# EAGLE board v1-1-0b (EAGLE 9.6.2), part 1 of 3
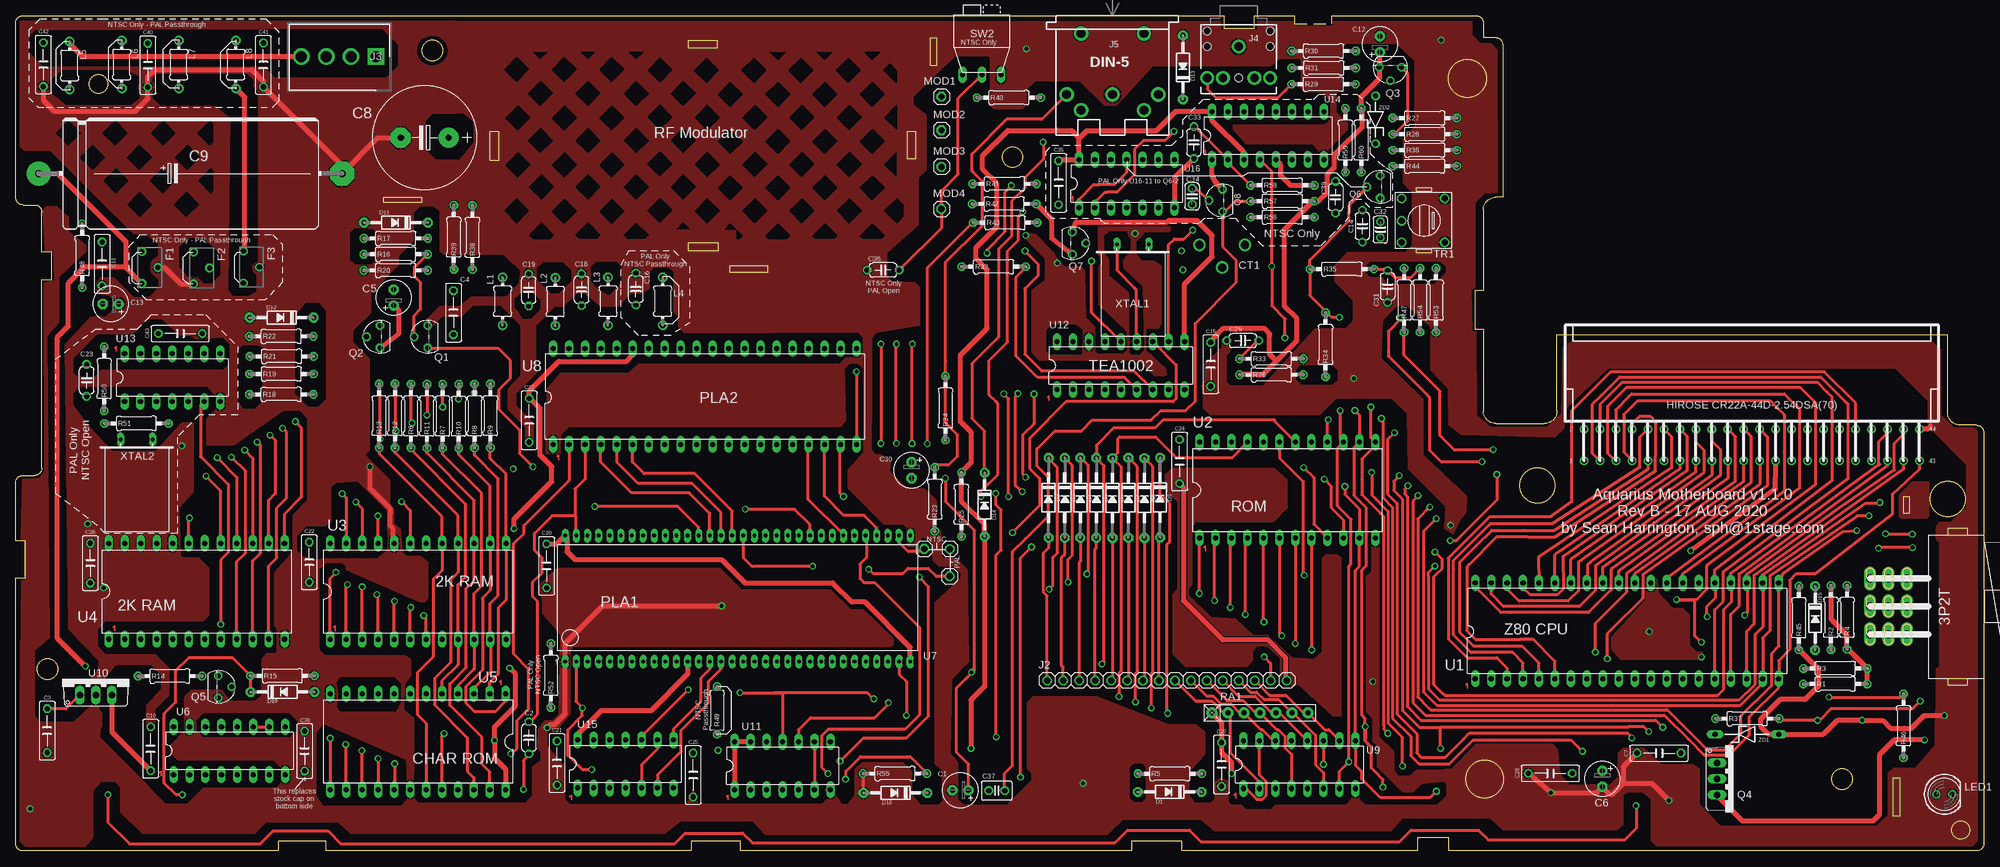
[diagram p2: board, top side]
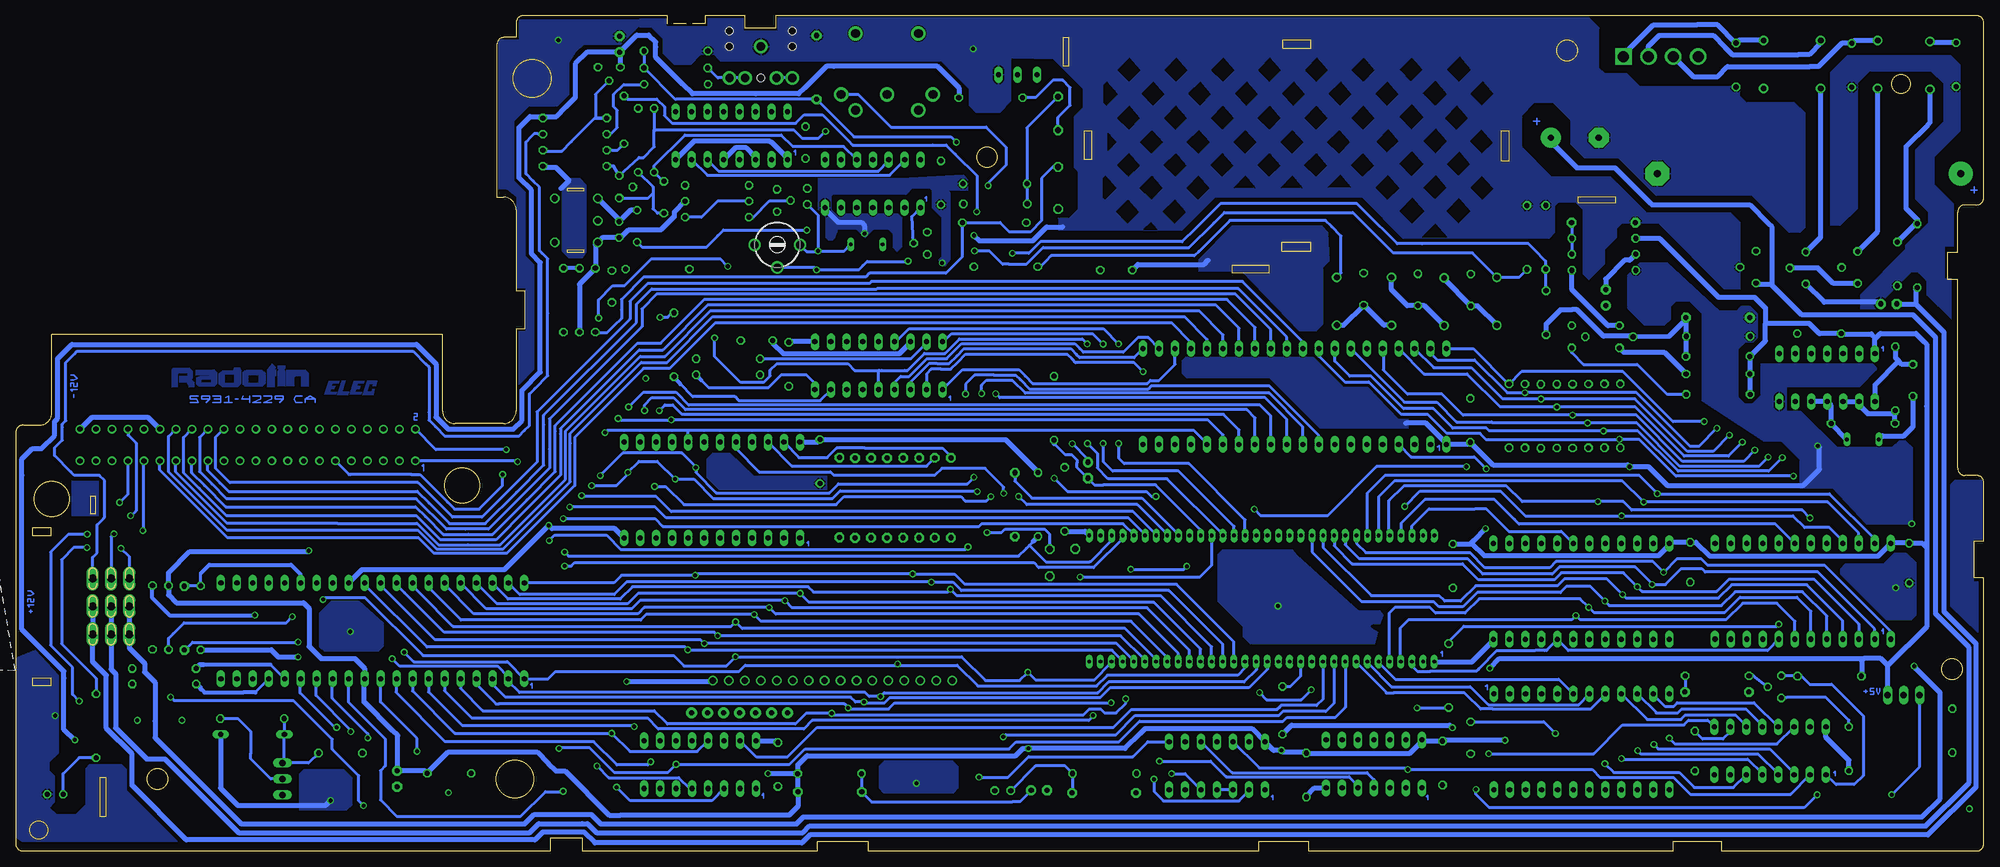
[diagram p3: board, bottom side, seen from below]

Size 313.03 x 132.89 mm. Coordinates in mm from the lower left corner, seen from the top.
Outline: 69 segments
Outline: circle at 5.03,28.96 radius 1.63
Outline: circle at 158.55,110.39 radius 1.63
Outline: circle at 290.47,11.46 radius 1.63
Outline: circle at 242.01,58.14 radius 2.79
Outline: circle at 307.31,56.03 radius 2.79
Outline: circle at 66.27,127.36 radius 1.63
Outline: circle at 13.13,122.02 radius 1.47
Copper layers (1*16): Top 0.035mm / dielectric 1.5mm / Bottom 0.035mm
Design rules "default *": minimum track width 6mil, minimum drill 0.35mm, track to track 6mil, track to pad 6mil, pad to pad 6mil, via to via 6mil, smd to smd 6mil, copper to edge 0mil, drill to drill 6mil, minimum pad ring 10mil, minimum via ring 8mil, stop-mask expansion 4mil, vias tented up to drill 0mil, thermal gap 10mil
Milling: area 230.6,8.4 to 236.6,14.4; area 227.9,119.9 to 233.9,125.9; area 307.9,1.9 to 310.8,4.7; 36 lines

## Footprints (pad centres in the part's own frame; a part is rotated, then mirrored left to right if it is on the bottom)
E2,5-6 = drill 0.813 pad 1.6: + -1.27,0 | drill 0.813 pad 1.6 octagon: - 1.27,0
C050-024X044 = drill 0.813 octagon: 1 -2.54,0; 2 2.54,0
C050-025X090 = drill 0.813 octagon: 1 -3.556,0; 2 3.429,0
E7,5-16 = drill 1.016 pad 3.15: + -3.81,0 | drill 1.016 pad 3.15 octagon: - 3.81,0
E45-18 = drill 1.118 pad 3.81: + -24.13,0 | drill 1.118 pad 3.81 octagon: - 24.13,0
C050-025X085 = drill 0.813 octagon: 1 -3.175,0; 2 3.175,0
C025-024X044 = drill 0.813 octagon: 1 -1.27,0; 2 1.27,0
C025-030X050 = drill 0.813 octagon: 1 -1.27,0; 2 1.27,0
CTRIM808-BC = drill 1.3: 1 -3.607,0; 2 0,3.607; 3 3.607,0
DO35-10 = drill 0.813 pad 1.524 octagon: A 5.08,0; C -5.08,0
DO35-12 = drill 0.813 pad 1.524 octagon: A 7.62,0; C -5.08,0
LCL = drill 0.813 octagon: 0 0,1.27; 1 -2.54,-1.27; 2 2.54,-1.27
CR22A-44D-2.54DSA(70) = drill 0.85: P$1 -25.4,-11.43; P$2 -25.4,-6.35; P$3 -22.86,-11.43; P$4 -22.86,-6.35; P$5 -20.32,-11.43; P$6 -20.32,-6.35; P$7 -17.78,-11.43; P$8 -17.78,-6.35; P$9 -15.24,-11.43; P$10 -15.24,-6.35; P$11 -12.7,-11.43; P$12 -12.7,-6.35; P$13 -10.16,-11.43; P$14 -10.16,-6.35; P$15 -7.62,-11.43; P$16 -7.62,-6.35; P$17 -5.08,-11.43; P$18 -5.08,-6.35; P$19 -2.54,-11.43; P$20 -2.54,-6.35; P$21 0,-11.43; P$22 0,-6.35; P$23 2.54,-11.43; P$24 2.54,-6.35; P$25 5.08,-11.43; P$26 5.08,-6.35; P$27 7.62,-11.43; P$28 7.62,-6.35; P$29 10.16,-11.43; P$30 10.16,-6.35; P$31 12.7,-11.43; P$32 12.7,-6.35; P$33 15.24,-11.43; P$34 15.24,-6.35; P$35 17.78,-11.43; P$36 17.78,-6.35; P$37 20.32,-11.43; P$38 20.32,-6.35; P$39 22.86,-11.43; P$40 22.86,-6.35; P$41 25.4,-11.43; P$42 25.4,-6.35; P$43 27.94,-11.43; P$44 27.94,-6.35
1X16 = drill 1.016: 1 -19.05,0; 2 -16.51,0; 3 -13.97,0; 4 -11.43,0; 5 -8.89,0; 6 -6.35,0; 7 -3.81,0; 8 -1.27,0; 9 1.27,0; 10 3.81,0; 11 6.35,0; 12 8.89,0; 13 11.43,0; 14 13.97,0; 15 16.51,0; 16 19.05,0
SHDR4W155P0X396_1X4_1570X1001X = drill 1.75 pad 2.625 square: 1 0,0 | drill 1.75 pad 2.625: 2 -3.96,0; 3 -7.92,0; 4 -11.88,0
AUDIO-JACK = drill 1.3 pad 2.184: RING 5,5; RSH 5,2.5; SLEEVE 0,0; TIP 5,-5; TSH 5,-2.5 | hole 1.2: 0,5; -2.5,5; -2.5,-5; 0,-5; 5,0
DIN5-RA-PTH = drill 1.4 pad 2.286: 1 7.3,12.5; 2 0,12.5; 3 -7.3,12.5; 4 5,15; 5 -5,15; 6 -5,2.8; 7 5,2.8
1X01 = drill 1.016 octagon: 1 0,0
TFI0305 = drill 0.9 pad 1.5: 1 -3.81,0; 2 3.81,0
LED5MM = drill 0.813 octagon: A -1.27,0; K 1.27,0
TO92-E1 = drill 0.813 octagon: 1 -1.778,0; 2 0,2.159; 3 1.778,0
TO220V = drill 1.016 long: 1 -2.54,-2.54; 2 0,-2.54; 3 2.54,-2.54
0207/10 = drill 0.813 octagon: 1 -5.08,0; 2 5.08,0
0207/7 = drill 0.813 octagon: 1 -3.81,0; 2 3.81,0
RN-7 = drill 0.813 pad 1.778: 1 -7.62,0; 2 -5.08,0; 3 -2.54,0; 4 0,0; 5 2.54,0; 6 5.08,0; 7 7.62,0
3PDT-AQ-SWITCH = drill 1.27 long: P$1A -2.921,0; P$1B -2.921,-4.445; P$1C -2.921,4.445; P$2A 0,0; P$2B 0,-4.445; P$2C 0,4.445; P$3A 2.921,0; P$3B 2.921,-4.445; P$3C 2.921,4.445
9077-1 = drill 0.813 long: 1 -3.048,-1.016; 2 0,-1.016; 3 3.048,-1.016
10MM-DUAL = drill 1: P$1 -3.556,-3.429; P$2 -3.556,3.556; P$3 3.302,-3.429; P$4 3.302,3.556
DIL40 = drill 0.813 long: 1 -24.13,-7.62; 2 -21.59,-7.62; 3 -19.05,-7.62; 4 -16.51,-7.62; 5 -13.97,-7.62; 6 -11.43,-7.62; 7 -8.89,-7.62; 8 -6.35,-7.62; 9 -3.81,-7.62; 10 -1.27,-7.62; 11 1.27,-7.62; 12 3.81,-7.62; 13 6.35,-7.62; 14 8.89,-7.62; 15 11.43,-7.62; 16 13.97,-7.62; 17 16.51,-7.62; 18 19.05,-7.62; 19 21.59,-7.62; 20 24.13,-7.62; 21 24.13,7.62; 22 21.59,7.62; 23 19.05,7.62; 24 16.51,7.62; 25 13.97,7.62; 26 11.43,7.62; 27 8.89,7.62; 28 6.35,7.62; 29 3.81,7.62; 30 1.27,7.62; 31 -1.27,7.62; 32 -3.81,7.62; 33 -6.35,7.62; 34 -8.89,7.62; 35 -11.43,7.62; 36 -13.97,7.62; 37 -16.51,7.62; 38 -19.05,7.62; 39 -21.59,7.62; 40 -24.13,7.62
DIL24-6 = drill 0.813 long: 1 -13.97,-7.62; 2 -11.43,-7.62; 3 -8.89,-7.62; 4 -6.35,-7.62; 5 -3.81,-7.62; 6 -1.27,-7.62; 7 1.27,-7.62; 8 3.81,-7.62; 9 6.35,-7.62; 10 8.89,-7.62; 11 11.43,-7.62; 12 13.97,-7.62; 13 13.97,7.62; 14 11.43,7.62; 15 8.89,7.62; 16 6.35,7.62; 17 3.81,7.62; 18 1.27,7.62; 19 -1.27,7.62; 20 -3.81,7.62; 21 -6.35,7.62; 22 -8.89,7.62; 23 -11.43,7.62; 24 -13.97,7.62
DIL16 = drill 0.813 long: 1 -8.89,-3.81; 2 -6.35,-3.81; 3 -3.81,-3.81; 4 -1.27,-3.81; 5 1.27,-3.81; 6 3.81,-3.81; 7 6.35,-3.81; 8 8.89,-3.81; 9 8.89,3.81; 10 6.35,3.81; 11 3.81,3.81; 12 1.27,3.81; 13 -1.27,3.81; 14 -3.81,3.81; 15 -6.35,3.81; 16 -8.89,3.81
HD61K202P-PLA1 = drill 0.6 long: 1 1.27,-1.778; 2 3.048,-1.778; 3 4.818,-1.778; 4 6.588,-1.778; 5 8.358,-1.778; 6 10.127,-1.778; 7 11.897,-1.778; 8 13.667,-1.778; 9 15.437,-1.778; 10 17.207,-1.778; 11 18.977,-1.778; 12 20.747,-1.778; 13 22.517,-1.778; 14 24.286,-1.778; 15 26.056,-1.778; 16 27.826,-1.778; 17 29.596,-1.778; 18 31.366,-1.778; 19 33.136,-1.778; 20 34.906,-1.778; 21 36.676,-1.778; 22 38.445,-1.778; 23 40.215,-1.778; 24 41.985,-1.778; 25 43.755,-1.778; 26 45.525,-1.778; 27 47.295,-1.778; 28 49.065,-1.778; 29 50.835,-1.778; 30 52.604,-1.778; 31 54.374,-1.778; 32 56.144,-1.778; 33 56.134,18.288; 34 54.356,18.288; 35 52.586,18.288; 36 50.816,18.288; 37 49.046,18.288; 38 47.277,18.288; 39 45.507,18.288; 40 43.737,18.288; 41 41.967,18.288; 42 40.197,18.288; 43 38.427,18.288; 44 36.657,18.288; 45 34.887,18.288; 46 33.118,18.288; 47 31.348,18.288; 48 29.578,18.288; 49 27.808,18.288; 50 26.038,18.288; 51 24.268,18.288; 52 22.498,18.288; 53 20.728,18.288; 54 18.959,18.288; 55 17.189,18.288; 56 15.419,18.288; 57 13.649,18.288; 58 11.879,18.288; 59 10.109,18.288; 60 8.339,18.288; 61 6.569,18.288; 62 4.8,18.288; 63 3.03,18.288; 64 1.26,18.288
DIL14 = drill 0.813 long: 1 -7.62,-3.81; 2 -5.08,-3.81; 3 -2.54,-3.81; 4 0,-3.81; 5 2.54,-3.81; 6 5.08,-3.81; 7 7.62,-3.81; 8 7.62,3.81; 9 5.08,3.81; 10 2.54,3.81; 11 0,3.81; 12 -2.54,3.81; 13 -5.08,3.81; 14 -7.62,3.81
DIL18 = drill 0.813 long: 1 -10.16,-3.81; 2 -7.62,-3.81; 3 -5.08,-3.81; 4 -2.54,-3.81; 5 0,-3.81; 6 2.54,-3.81; 7 5.08,-3.81; 8 7.62,-3.81; 9 10.16,-3.81; 10 10.16,3.81; 11 7.62,3.81; 12 5.08,3.81; 13 2.54,3.81; 14 0,3.81; 15 -2.54,3.81; 16 -5.08,3.81; 17 -7.62,3.81; 18 -10.16,3.81
Q = drill 0.61 long: 1 -2.54,-7.62; 2 2.54,-7.62
ZDIO-10 = drill 0.813 long: A 5.08,0; C -5.08,0
ZDIO-7.5 = drill 0.813 octagon: A 3.81,0; C -3.81,0

## Placement (x,y rotation side)
C1  1uF @ 50v  [E2,5-6]  150.24,9.63 180 top
C2  10pF  [C050-024X044]  81.61,18.01 270 top
C3  .22uF  [C050-025X090]  5,19.08 270 top
C4  .1uF  [C050-025X090]  69.62,85.57 270 top
C5  2.2uF @ 50v  [E2,5-6]  60.12,88.06 90 top
C6  47uF @ 10v  [E2,5-6]  252.37,11.51 270 top
C7  .1uF @ 25v  [C050-025X090]  261.44,15.57 0 top
C8  1000uF @ 25v  [E7,5-16]  65.05,113.49 180 top
C9  10000uF @ 16v  [E45-18]  27.76,107.8 0 top
C10  .1uF  [C050-025X090]  21.46,16.21 270 top
C11  .1uF  [C050-025X090]  13.74,93.34 270 top
C12  10uF @ 16v  [E2,5-6]  216.99,128.35 90 top
C13  10uF @ 25v  [E2,5-6]  15.14,87.05 180 top
C14  .022uF  [C050-024X044]  214.2,99.42 90 top
C15  .1uF  [C050-025X090]  190.07,77.37 270 top
C16  82pF  [C050-024X044]  98.63,89.41 270 top
C17  .1uF  [C050-025X090]  81.66,68.45 270 top
C18  82pF  [C050-024X044]  89.99,89.31 270 top
C19  82pF  [C050-024X044]  81.58,89.26 270 top
C20  .1uF  [C050-025X090]  84.43,45.29 270 top
C21  .1uF  [C050-025X090]  86.08,13.92 270 top
C22  .1uF  [C050-025X085]  46.69,45.95 270 top
C23  10pF  [C050-024X044]  11.28,74.88 270 top
C24  .1uF  [C050-025X090]  185.12,61.9 270 top
C25  .1uF  [C050-025X090]  107.75,12.01 270 top
C26  .1uF  [C050-025X085]  11.86,45.8 270 top
C27  .1uF  [C050-025X090]  191.8,13.69 270 top
C28  .1uF  [C050-025X090]  244.14,12.34 0 top
C29  150pF  [C050-024X044]  195.17,81.2 0 top
C30  10uF @ 16v  [E2,5-6]  142.47,60.58 270 top
C31  .1uF  [C050-024X044]  218.21,89.81 90 top
C32  100pF  [C025-024X044]  217.07,98.86 90 top
C33  680pF  [C050-024X044]  187.4,112.73 90 top
C34  2pF  [C025-024X044]  187.12,104.14 90 top
C35  .1uF  [C050-025X090]  165.86,106.25 270 top
C36  .01uF  [C050-024X044]  137.97,92.43 0 top
C37  .001uF  [C025-030X050]  156.03,9.6 0 top
C38  .1uF  [C050-025X085]  45.95,15.9 90 top
C39  56pF  [C050-024X044]  209.93,104.01 90 top
C40  .02uF  [C050-025X090]  21.01,124.94 270 top
C41  .02uF  [C050-025X090]  39.4,124.99 270 top
C42  .02uF  [C050-025X090]  4.39,125.04 270 top
C43  .1uF  [C050-025X090]  26.24,82.32 0 top
CT1  [CTRIM808-BC]  191.9,96.44 180 bottom
D1  1N4148  [DO35-10]  183.54,9.4 180 top
D2  1N4148H  [DO35-12]  164.29,57.45 270 top
D3  1N4148H  [DO35-12]  166.85,57.45 270 top
D4  1N4148H  [DO35-12]  169.34,57.45 270 top
D5  1N4148H  [DO35-12]  171.88,57.45 270 top
D6  1N4148H  [DO35-12]  174.45,57.43 270 top
D7  1N4148H  [DO35-12]  176.99,57.45 270 top
D8  1N4148H  [DO35-12]  179.53,57.43 270 top
D9  1N4148H  [DO35-12]  182.02,57.51 270 top
D10  1N4148  [DO35-10]  42.44,25.3 0 top
D11  1N4148  [DO35-10]  60.48,99.97 180 top
D12  1N4148  [DO35-10]  42.29,84.86 180 top
D13  1N4148  [DO35-10]  185.65,124.66 90 top
D14  1N4148  [DO35-10]  154.1,55.09 270 top
D15  1N4148  [DO35-10]  286.21,37.06 270 top
D16  1N4148  [DO35-10]  139.93,9.25 180 top
F1  [LCL]  21.34,92.84 270 top
F2  [LCL]  29.57,92.76 270 top
F3  [LCL]  37.49,92.89 270 top
J1  CR22A-44D-2.54DSA(70)  [CR22A-44D-2.54DSA(70)]  274.85,73.48 0 top
J2  [1X16]  183.11,27.13 0 top
J3  26-60-4040  [SHDR4W155P0X396_1X4_1570X1001X]  57.3,126.39 0 top
J4  AUDIO_JACK_3.5MM_PTH  [AUDIO-JACK]  194.51,127.99 270 top
J5  DIN5  [DIN5-RA-PTH]  174.45,132.87 180 top
JP1  [1X01]  148.54,43.71 0 top
JP2  [1X01]  144.5,48.06 0 top
JP3  [1X01]  148.56,48.03 0 top
L1  [TFI0305]  77.44,87.45 90 top
L2  [TFI0305]  85.83,87.4 90 top
L3  [TFI0305]  94.21,87.45 90 top
L4  [TFI0305]  102.9,87.48 90 top
L5  [TFI0305]  8.59,124.97 270 top
L6  [TFI0305]  16.87,125.12 270 top
L7  [TFI0305]  25.93,125.12 270 top
L8  [TFI0305]  35,125.15 270 top
LED1  [LED5MM]  306.76,9.02 0 top
MOD1  [1X01]  147.24,120.02 0 top
MOD2  [1X01]  147.24,114.68 0 top
MOD3  [1X01]  147.24,108.86 0 top
MOD4  [1X01]  147.22,102.13 0 top
Q1  [TO92-E1]  65.53,81.81 90 top
Q2  [TO92-E1]  57.94,81.81 90 top
Q3  [TO92-E1]  218.64,124.71 180 top
Q4  [TO220V]  273.18,11.46 270 top
Q5  [TO92-E1]  32.21,26.11 270 top
Q6  [TO92-E1]  217.04,105.66 90 top
Q7  [TO92-E1]  168.05,96.7 270 top
Q8  [TO92-E1]  191.95,103.5 90 top
R1  1k  [0207/10]  289.41,26.57 0 top
R2  1k  [0207/10]  288.72,37.13 90 top
R3  1k  [0207/10]  289.43,29.03 0 top
R4  1k  [0207/10]  291.29,37.16 90 top
R5  10k  [0207/10]  183.57,12.29 0 top
R6  820  [0207/10]  62.87,69.22 90 top
R7  820  [0207/10]  67.89,69.19 90 top
R8  820  [0207/10]  72.97,69.22 90 top
R9  820  [0207/10]  75.49,69.24 90 top
R10  820  [0207/10]  70.46,69.16 90 top
R11  820  [0207/10]  65.41,69.19 90 top
R12  820  [0207/10]  60.33,69.24 90 top
R13  820  [0207/10]  57.81,69.24 90 top
R14  2.2k  [0207/10]  24.54,27.81 0 top
R15  1.2k  [0207/10]  42.42,27.86 0 top
R16  2.7k  [0207/10]  60.43,94.95 0 top
R17  56k  [0207/10]  60.45,97.46 0 top
R18  2.7k  [0207/10]  42.24,72.64 0 top
R19  2.7k  [0207/10]  42.27,75.9 0 top
R20  390k  [0207/10]  60.43,92.38 0 top
R21  560k  [0207/10]  42.29,78.69 0 top
R22  56k  [0207/10]  42.24,81.89 0 top
R23  100  [0207/10]  146.18,55.96 90 top
R24  10k  [0207/10]  147.88,70.46 90 top
R25  4.7k  [0207/10]  150.42,55.12 90 top
R26  10k  [0207/10]  199.72,75.77 0 top
R27  10k  [0207/10]  224.1,116.61 0 top
R28  2.2k  [0207/10]  224.1,114.05 0 top
R29  100  [0207/10]  208,122 0 top
R30  10k  [0207/10]  208.03,127.28 0 top
R31  3.9k  [0207/10]  208.05,124.59 0 top
R32  820  [0207/10]  155.55,92.96 0 top
R33  1.2k  [0207/10]  199.72,78.31 0 top
R34  6.8k  [0207/10]  208.33,80.54 90 top
R35  2.7k  [0207/10]  210.95,92.58 0 top
R36  1.8k  [0207/10]  224.1,111.51 0 top
R37  560  [0207/10]  275.41,21.06 0 top
R38  820  [0207/10]  72.64,97.61 90 top
R39  82  [0207/10]  69.67,97.64 90 top
R40  180  [0207/10]  157.96,119.86 0 top
R41  680  [0207/10]  157.28,106.15 0 top
R42  510  [0207/10]  157.23,102.95 0 top
R43  4.7k  [0207/10]  157.38,99.97 0 top
R44  470  [0207/10]  224.1,108.97 0 top
R45  47k  [0207/10]  283.62,37.08 90 top
R46  510  [0207/10]  300.25,19.91 90 top
R47  4.7k  [0207/10]  220.83,87.63 90 top
R48  1.8k  [0207/10]  10.57,94.72 90 top
R49  0  [0207/7]  111.56,22.35 90 top
R50  56k  [0207/10]  14.07,75.13 90 top
R51  56k  [0207/10]  19.2,68.02 0 top
R52  56k  [0207/10]  85.12,27.91 90 top
R53  1k  [0207/10]  225.91,87.63 90 top
R54  1.8k  [0207/10]  223.37,87.63 90 top
R55  47k  [0207/10]  139.85,12.32 0 top
R56  100k  [0207/10]  201.47,100.84 0 top
R57  1k  [0207/10]  201.47,103.38 0 top
R58  10k  [0207/10]  201.47,105.92 0 top
R59  180  [0207/10]  211.48,113.08 90 top
R60  470  [0207/10]  214.02,113.08 90 top
RA1  33k  [RN-7]  197.89,22 0 top
SW1  3PDT-AQ-SWITCH  [3PDT-AQ-SWITCH]  297.87,38.91 0 top
SW2  9077-1  [9077-1]  153.67,124.51 0 top
TR1  [10MM-DUAL]  224,100.28 0 top
U1  [DIL40]  256.26,35.03 0 top
U2  [DIL24-6]  202.29,57.43 0 top
U3  [DIL24-6]  64.01,41.3 0 top
U4  [DIL24-6]  28.78,41.33 0 top
U5  [DIL24-6]  63.98,17.37 180 top
U6  74LS165N  [DIL16]  33.99,15.95 0 top
U7  HD61K202P-PLA1  [HD61K202P-PLA1]  86.13,31.9 0 top
U8  [DIL40]  109.58,72.31 0 top
U9  74367N  [DIL16]  204.19,13.74 0 top
U10  7805  [TO220V]  12.75,27.36 0 top
U11  74LS10N  [DIL14]  121.95,13.56 0 top
U12  [DIL18]  175.77,77.22 0 top
U13  74LS04N  [DIL14]  24.92,75.31 0 top
U14  4528N  [DIL16]  199.16,113.82 0 top
U15  74LS86N  [DIL14]  96.98,13.84 0 top
U16  744066N  [DIL14]  176.71,106.17 0 top
XTAL1  7.15909 MhZ  [Q]  177.67,88.9 180 top
XTAL2  7.15909 Mhz  [Q]  19.23,57.86 180 top
ZD1  [ZDIO-10]  275.36,18.57 0 top
ZD2  [ZDIO-7.5]  216.28,116.33 90 top

## Tracks (layer width: path | path; a pad name or v marks a point on that pad's centre or on a via)
2Φ  (via drill 0.65)
  Top 0.508: 90.12,22.81 90.12,21.57 87.86,19.3 87.86,15.19 90.17,12.88 91.59,12.88 91.62,12.9 v91.62,12.95 | 90.12,22.81 89.43,23.5 89.13,23.8 89.13,30.07 U7.2 | v90.14,22.76 90.14,22.78 90.12,22.81
  Bottom 0.508: U11.12 115.24,13.21 91.87,13.21 v91.62,12.95 62.28,12.95 61.04,11.71 49.35,11.71 46.69,9.04 30.73,9.04 U6.2 | v90.14,22.76 85.19,22.76 R52.1
!4/Φ  (via drill 0.65)
  Top 0.508: 88.95,53.31 85.29,53.31 82.5,50.52 82.5,47.85 83.74,46.61 83.74,46.2 83.74,44.27 82.25,42.77 82.25,40.46 83.01,39.7 83.01,21.77 81.79,20.55 C2.1 | U8.3 90.53,59.18 88.95,57.61 88.95,53.31 | U7.63 89.16,53.1 88.95,53.31 | v68.15,18.69 68.17,18.67 67.74,18.24 67.74,9.8 U5.20
  Bottom 0.508: C2.1 70,20.55 v68.15,18.69
!BUSAK  (via drill 0.65)
  Top 0.152: v275.01,37.52 275.03,37.49
  Top 0.508: 275.03,37.49 275.39,37.85 275.39,42.57 U1.23 275.31,44.03 290.06,54.61 298.81,60.6 298.81,64.85 300.25,66.29 J1.P$42
  Bottom 0.61: R4.2 291.29,40.23 288.57,37.52 v275.01,37.52
!BUSREQ  (via drill 0.65)
  Top 0.508: v269.04,37.29 269.04,37.21 269.01,37.19 269.01,38.94 269.6,39.52 270.31,40.23 270.31,42.57 U1.25 270.23,44.72 288.9,58.92 288.9,72.24 288.09,73.05 286.54,74.6 283.44,74.6 255.52,74.6 254.76,73.84 251.97,71.04 251.97,67.16 J1.P$4
  Bottom 0.508: v269.04,37.29 270,36.32 286.26,36.32 288.01,34.57 288.72,33.86 R2.1
!CBLK  (via drill 0.65)
  Top 0.508: v140.08,80.64 140.08,80.57 140.06,80.54 140.06,64.72 140.08,64.75 v140.08,64.85
  Bottom 0.508: v140.08,80.64 141.76,82.32 164.19,82.32 165.48,81.03 U12.18 | v140.08,64.85 140.08,61.95 138.58,60.45 128.07,60.45 119.25,51.63 U7.46
!CE  (via drill 0.65)
  Top 0.508: v235.59,59.89 235.59,59.92 235.61,59.94 235.61,55.85 229.29,49.53 229.16,49.4 228.19,49.4 v228.17,49.38 | v159.82,11.73 159.82,11.71 159.84,11.68 159.84,46.63 161.59,48.39 v161.57,48.36
  Bottom 0.508: v235.59,59.89 235.59,58.12 239.29,54.41 240.41,54.41 243.23,54.41 244.35,55.52 248.72,59.89 250.09,59.89 259.82,59.89 259.99,59.89 J1.P$11 | v228.17,49.38 227.31,50.24 219.07,50.24 216.79,47.95 161.98,47.95 v161.57,48.36 | v159.82,11.73 155.19,11.73 151.94,14.99 135.36,14.99 132.94,17.4 129.59,17.4 U11.8
!CSYNC  (via drill 0.65)
  Top 0.508: v220.32,84.78 220.37,84.78 220.4,84.76 218.31,82.68 218.31,79.45 218.31,78.74 224.69,72.36 224.84,72.21 224.84,63.83 226.8,61.87 233.15,61.87 233.17,61.87 v233.22,61.92 | 199.77,87.63 199.77,92.96 199.72,93.02 199.72,107.34 199.72,108.18 U14.4 | 199.77,87.63 199.77,86.77 201.91,84.63 201.88,84.61 v201.88,81.64 | v199.77,93.02 199.77,87.63 | v142.6,80.67 142.6,80.62 142.6,64.72 142.6,64.8 v142.57,64.82
  Bottom 0.508: 233.24,61.91 v233.22,61.92 233.35,62.05 J1.P$1 | v220.32,84.78 220.32,87.68 218.08,89.92 216.21,89.92 211.91,94.21 200.97,94.21 v199.77,93.02 | 175.77,76.45 179.58,76.45 180.67,77.55 191.95,77.55 193.01,76.48 193.01,75.59 194.06,74.55 197.74,74.55 201.88,78.69 v201.88,81.64 | 175.77,76.45 175.67,76.45 175.26,76.45 171.65,76.45 171.22,76.45 168.5,79.17 165.23,79.17 162.94,81.46 143.38,81.46 v142.6,80.67 | v142.57,64.82 141,63.25 141,60.94 139.27,59.21 129.89,59.21 121.02,50.33 U7.45 | U12.5 175.77,76.45
!DBE
  Top 0.508: U8.6 98.09,64.64 98.09,61.85 99.92,60.02 108,60.02 113.94,54.08 U7.49
!EXBE
  Top 0.508: U8.5 95.61,61.87 98.98,58.5 107.57,58.5 112.17,53.9 U7.50
!HALT
  Top 0.508: J1.P$41 300.25,60.75 276.48,43.86 276.48,36.12 275.31,34.95 U1.18
!INT
  Top 0.508: J1.P$3 250.72,63.32 250.72,71.02 252.12,72.42 255.14,75.44 287.1,75.44 290.96,71.58 291.44,71.09 291.44,59.26 271.58,44.37 271.58,39.73 270.23,38.38 U1.16
  Bottom 0.508: U1.16 272.47,29.64 272.54,29.64
  Bottom 0.61: 283.13,29.64 279.6,29.64 272.54,29.64
  Bottom 0.813: 283.13,29.64 283.74,29.64 R3.1
!IORQ  (via drill 0.65)
  Top 0.152: v223.01,56.54 223.01,56.49
  Top 0.508: 223.01,56.49 223.05,56.45 222.25,55.65 222.25,23.6 224.23,21.61 262.2,21.61 266.01,17.8 268.5,15.32 272.57,15.32 275.74,18.49 275.74,20.65 275.74,21.31 280.39,25.96 U1.20 280.39,30.28 282.17,32.05 282.17,43.05 283.16,44.04 286.15,44.04 298.45,53.61 298.45,56.74 302.79,60.73 J1.P$43 | U8.17 126.01,64.62 126.01,55.96 131.64,50.33 U7.39
  Bottom 0.508: v223.01,56.54 222.94,56.46 211.25,56.46 208.79,54 135.31,54 131.64,50.33 U7.39
!KEY
  Top 0.508: U9.1 195.67,9.93 197.4,8.2 198.28,8.2 198.91,8.83 198.91,11.03 197.84,12.1 U9.15
  Bottom 0.508: U9.15 197.82,17.55 195.18,14.91 190.32,14.91 190.25,14.99 189.25,15.98 185.57,19.66 177.75,19.66 138.46,19.66 135.59,22.53 129.69,22.53 112.42,22.53 112.14,22.81 111.81,23.14 106.12,23.14 105.11,24.15 U7.11
!LAEB  (via drill 0.65)
  Top 0.508: U8.4 93.02,64.64 93.02,61.92 97.97,56.97 107.14,56.97 110.4,53.71 U7.51
  Bottom 0.508: v79.15,60.81 81.03,62.69 91.08,62.69 91.08,62.71 U8.4
!M1
  Top 0.508: J1.P$6 254.48,67.18 254.48,70.18 256.49,72.19 257.02,72.72 281.31,72.72 283.74,70.28 283.74,57.72 265.15,44.1 U1.27
!MREQ  (via drill 0.65)
  Top 0.508: v225.93,52.88 223.9,50.85 223.9,25.3 225.73,23.47 226.01,23.19 253.87,23.19 274.32,23.19 277.85,26.72 U1.19 277.85,33.88 279.1,35.13 279.1,43.84 292.88,53.34 v294.77,53.34 | U7.37 135.36,50.01 135.36,46.74 134.59,45.97 134.26,45.64 134.26,43.36 134.9,42.72 136.63,42.72 143.74,35.61 143.74,21.69 141.43,19.38 129.24,19.38 128.25,18.39 128.25,13.23 v129.18,12.29
  Bottom 0.508: v294.77,53.34 294.77,53.31 294.74,53.29 293.9,54.13 293.9,64.9 295.17,66.17 J1.P$38 | v225.93,52.88 211.35,52.88 210.13,51.66 159.79,51.66 159.41,52.05 136.89,52.05 135.18,50.33 U7.37 | U11.5 127.03,12.29 v129.18,12.29
!MRST  (via drill 0.65)
  Top 0.508: v268.12,33.22 268.07,33.17 267.06,34.19 267.06,36.63 267.06,39.95 264.11,39.95 v264.16,40.01 264.19,39.98 267.28,39.98 268.99,41.68 268.99,43.03 268.99,45.4 286.31,58.3 286.31,71.3 283.85,73.76 256.21,73.76 253.26,70.81 253.26,63.22 254.43,62.05 J1.P$5 | v198.55,30.91 198.58,30.89 199.59,29.87 199.59,29.01 199.59,27.15 J2.15 | 150.13,26.4 149.66,25.93 149.66,15.7 151.56,13.79 151.56,9.68 C1.+ | 150.13,26.4 152.02,28.3 152.53,28.8 152.53,50.98 147.88,55.63 147.88,59.38 147.85,59.36 v147.85,59.31 | v152.04,28.45 152.04,28.32 150.13,26.4 | v131.67,56.41 131.72,56.36 131.72,56.26 131.09,56.9 131.09,64.62 U8.19
  Bottom 0.508: v268.12,33.22 284.91,33.22 286.16,31.98 D15.A | v264.16,40.01 263.83,40.34 257.5,40.34 248.26,31.09 208.38,31.09 206.73,29.44 200,29.44 198.55,30.89 v198.55,30.91 162.59,30.91 158.8,27.13 153.37,27.13 v152.04,28.45 150.77,27.18 141.54,27.18 138.74,29.98 U7.30 | v147.85,59.31 145.72,57.17 133.17,57.17 132.41,56.41 v131.67,56.41 | R5.1 178.49,9.42 D1.A 176.95,7.89 176.95,7.85 154.48,7.85 153.26,7.85 151.51,9.6 C1.+
!NMI
  Top 0.508: U1.17 272.77,37.67 274.12,39.01 274.12,42.14 274.12,44.09 297.71,61.31 J1.P$39
  Bottom 0.508: U1.17 272.77,27.36 274.93,25.2
  Bottom 0.61: 283.54,25.76 282.98,25.2 276.88,25.2 274.93,25.2
  Bottom 0.813: 283.54,25.76 284.33,26.54 R1.1
!PL
  Bottom 0.508: U6.1 23.52,10.57 23.42,10.57 20.6,10.57 19.2,11.96 19.2,21.51 24.21,26.52 27.69,26.52 28.98,27.81 R14.2 29.69,27.89 Q5.1
!R/W  (via drill 0.65)
  Top 0.508: v92.1,54.81 92.13,54.81 105.31,54.81 108.63,51.49 U7.52 | U3.21 57.66,53.26 v57.61,53.31
  Bottom 0.508: v92.1,54.81 89.66,57.25 76.86,57.25 72.92,53.31 v57.61,53.31 30.35,53.31 28.5,51.46 24.56,51.46 22.43,49.33 U4.21
!RD  (via drill 0.65)
  Top 0.508: 224.87,54.71 223.01,52.86 223.01,24.49 224.61,22.89 225.02,22.48 262.66,22.48 268.88,16.26 268.88,16.1 271.86,16.1 274.42,18.67 274.42,21.46 278.97,26.01 279.32,26.36 279.32,31.47 280.47,32.61 280.47,42.57 U1.21 281.18,44.2 290.65,50.8 v292.81,50.98
  Top 0.61: v224.92,54.71 224.87,54.71
  Bottom 0.508: v224.92,54.71 211.3,54.71 209.57,52.98 136.06,52.98 133.41,50.33 U7.38 | v292.81,50.98 292.63,51.16 J1.P$35
!RFSH
  Top 0.508: J1.P$7 257.07,62.2 255.78,63.5 255.78,69.44 257.23,70.89 257.99,71.65 277.44,71.65 279.04,71.65 280.14,70.56 281.28,69.42 281.28,63.45 281.28,57.29 262.61,43.43 U1.28
!RM1
  Bottom 0.508: U3.18 67.21,50.85 75.56,50.85 79.15,54.43 80.92,54.43 88.24,54.43 90.93,51.74 U7.62
!RM2
  Bottom 0.508: U4.18 33.12,52.02 73.91,52.02 74.65,52.76 77.85,55.96 88.14,55.96 88.88,55.96 92.7,52.13 U7.61
!ROM  (via drill 0.65)
  Top 0.508: v155.88,56.9 155.88,56.82 155.85,56.79 155.85,55.14 156.72,54.28 156.72,47.88 155.96,47.12 155.96,18.06 v155.96,18.14
  Bottom 0.508: v155.96,18.14 155.57,18.52 138.01,18.52 134.99,21.54 112.14,21.54 111.48,22.2 104.65,22.2 103.34,23.51 U7.10 | v155.88,56.9 155.88,57.91 158.85,60.88 165.74,60.88 166.85,59.77 182.91,59.77 183.46,60.33 194.79,60.33 198.48,64.01 U2.20
!RST
  Bottom 0.508: 283.26,44.5 283.64,44.12 283.62,44.09 R45.2 286.18,42.16 D15.C | U1.26 267.69,43.99 267.72,44.02
  Bottom 0.61: 283.59,44.17 283.26,44.5 282.22,45.54 269.24,45.54 268.33,44.63 267.72,44.02
!WAIT  (via drill 0.65)
  Top 0.152: v225.73,47.55 225.73,47.57
  Top 0.508: 225.73,47.57 226.85,46.46 226.85,45.64 226.85,44.91 225.83,43.89 225.53,43.59 225.53,26.49 227,25.02 227.03,25.02 227.28,24.77 270.71,24.77 271.68,25.73 271.68,37.31 271.68,38.43 272.9,39.65 272.9,42.52 U1.24 272.77,44.19 296.5,61.55 296.32,61.36 296.32,65.13 297.71,66.52 J1.P$40
  Bottom 0.508: v225.73,47.55 225.1,46.92 153.51,46.92 152.29,48.15 151.8,48.63 | 151.8,48.63 151.16,49.28 | 151.8,48.63 151.78,48.63 149.17,46.02 142.24,46.02 142.06,46.02 138.72,49.37 U7.35
  Bottom 0.813: 151.16,49.28 150.42,50.01 R25.1
!WR  (via drill 0.65)
  Top 0.508: 225.68,45.29 224.71,44.32 224.71,43.66 224.71,25.76 226.47,24 274.14,24 276.68,26.54 276.68,34.44 277.77,35.53 277.9,35.66 277.9,42.6 U1.22 277.85,43.93 294.36,55.36 296.49,55.4 | U8.18 128.63,56.46 131.67,53.42 134.95,53.42 136.95,51.42 U7.36
  Top 0.61: v296.52,55.45 296.52,55.42 296.49,55.4 | v225.73,45.34 225.68,45.29
  Bottom 0.508: v225.73,45.34 224.69,45.34 224.13,45.9 151.1,45.9 150.32,45.11 141.58,45.11 136.95,49.74 U7.36 | v296.52,55.45 295.17,56.79 J1.P$37
A00  (via drill 0.65)
  Top 0.508: U1.30 257.53,44.14 277.37,58.34 277.39,58.36 J1.P$23 | U2.8 206.1,32.03 v206.12,32
  Bottom 0.508: U1.30 257.53,42.34 247.62,32.44 206.55,32.44 v206.12,32 206.05,31.93 138.63,31.93 136.97,30.27 U7.29
A01  (via drill 0.65)
  Top 0.508: U1.31 254.99,44.55 274.83,58.77 274.83,62.03 J1.P$21 | U2.7 203.56,33.05 v203.5,32.99
  Bottom 0.508: 253.69,40.95 246.35,33.6 204.11,33.6 v203.5,32.99 137.92,32.99 135.2,30.27 U7.28 | 253.69,40.95 253.85,41.1 | 253.69,40.95 254.99,42.24 U1.31
A02  (via drill 0.65)
  Top 0.508: U2.6 201.02,34.59 v201.37,34.24 | J1.P$19 272.31,59.23 252.45,45.13 U1.32
  Bottom 0.508: 251.09,41.01 244.88,34.8 201.93,34.8 v201.37,34.24 137.29,34.24 133.43,30.38 U7.27 | 251.09,41.01 251.21,41.12 | 251.09,41.01 252.45,42.37 U1.32
A03  (via drill 0.65)
  Top 0.508: U1.33 250.01,42.75 249.99,44.2 249.99,45.58 250.44,45.91 250.81,46.28 269.8,59.82 269.8,62.03 J1.P$17 | v198.53,36.45 198.48,36.5 U2.5
  Bottom 0.508: 248.65,40.91 243.51,35.76 199.21,35.76 v198.53,36.45 197.49,35.41 136.58,35.41 131.66,30.49 U7.26 | 248.65,40.91 248.97,41.22 | 248.65,40.91 249.91,42.16 U1.33
A04  (via drill 0.65)
  Top 0.508: v195.58,37.62 195.58,49.45 U2.4 | J1.P$15 267.23,60.33 247.39,46.44 247.37,46.41 U1.34
  Bottom 0.508: 246.23,40.79 242.19,36.75 213.64,36.75 212.78,37.62 v195.58,37.62 194.51,36.55 135.61,36.55 129.89,30.83 U7.25 | 246.23,40.79 246.46,41.02 | 246.23,40.79 247.37,41.94 U1.34
A05  (via drill 0.65)
  Top 0.508: v193.19,38.73 193.19,49.61 U2.3 | J1.P$13 264.69,60.79 244.95,47.25 244.83,47.13 U1.35
  Bottom 0.508: U1.35 244.83,42.42 240.16,37.74 214.05,37.74 213.06,38.73 v193.19,38.73 192.15,37.69 134.39,37.69 128.12,31.42 U7.24
A06  (via drill 0.65)
  Top 0.508: v190.68,39.83 190.68,49.63 U2.2 | J1.P$12 263.42,65.86 263.42,61.02 242.25,46.77 242.31,42.67 U1.36
  Bottom 0.508: U1.36 242.29,42.62 238.2,38.53 215.04,38.53 213.74,39.83 v190.68,39.83 189.53,38.68 133.1,38.68 126.35,31.93 U7.23
A07  (via drill 0.65)
  Top 0.508: U1.37 239.75,41.88 240.89,40.74 241.91,40.74 245.19,40.74 246.2,41.76 246.16,46.85 265.91,60.56 265.91,65.91 J1.P$14 | v188.26,40.97 188.26,49.76 U2.1
  Bottom 0.508: U1.37 239.75,42.6 236.47,39.32 215.72,39.32 214.07,40.97 v188.26,40.97 186.87,39.57 132,39.57 124.58,32.15 U7.22
A08  (via drill 0.65)
  Top 0.508: D2.C 164.29,62.38 165.35,61.32 165.68,60.98 165.68,47.42 164.98,46.71 164.98,42.24 v164.36,41.63 | U1.38 237.21,41.66 239.09,39.78 243.43,39.78 246.91,39.78 248.62,41.48 248.62,45.98 268.55,60.23 268.55,63.75 267.69,64.62 267.23,65.08 J1.P$16
  Bottom 0.508: D2.C 164.29,62.76 165.63,64.11 177.98,64.11 182.45,64.11 183.97,62.59 188.44,62.59 188.44,62.64 U2.23 | U1.38 237.21,42.55 234.75,40.08 216.87,40.08 214.91,42.03 186.99,42.03 186.16,41.2 164.79,41.2 v164.36,41.63 163.32,40.59 130.89,40.59 122.81,32.51 U7.21
A09  (via drill 0.65)
  Top 0.508: D3.C 168.07,61.32 168.07,47.07 167.39,46.38 v167.39,42.77 | U1.39 234.67,40.87 236.65,38.89 242.7,38.89 248.69,38.89 251.28,41.48 251.28,45.36 271.12,59.71 271.12,63.91 269.77,65.25 J1.P$18
  Bottom 0.508: D3.C 168.15,61.24 168.96,61.24 189.61,61.24 189.61,61.27 U2.22 | U1.39 234.67,42.62 232.87,40.82 217.83,40.82 215.77,42.88 167.49,42.88 v167.39,42.77 163.96,42.77 162.64,41.45 129.62,41.45 121.04,32.87 U7.20
A10  (via drill 0.65)
  Top 0.508: v204.95,43.87 204.93,43.89 204.83,43.89 204.83,58.73 201.19,62.36 201.02,62.53 U2.19 | D4.C 169.42,62.53 170.56,61.39 170.56,44.27 v170.36,44.07 | U1.40 232.13,42.01 236.22,37.92 237.87,37.92 250.14,37.92 253.82,41.6 253.82,44.86 273.53,58.83 273.53,65.91 J1.P$20
  Bottom 0.508: 231.14,42.67 217.88,42.67 216.69,43.87 v204.95,43.87 204.75,44.07 v170.36,44.07 163.73,44.07 162.08,42.42 128.4,42.42 119.27,33.29 U7.19 | 231.14,42.67 231.27,42.67 | 231.14,42.67 232.1,42.67 U1.40
A11  (via drill 0.65)
  Top 0.508: v251.26,31.62 251.23,31.6 251.23,36.17 256.29,41.22 256.29,44.19 276.05,58.6 276.02,61.44 276.02,65.96 J1.P$22 | v172.75,29.74 173.13,30.12 173.13,51.1 173.13,61.29 D5.C 171.88,64.54 174.68,67.33 175.67,67.33 181.25,67.33 182.47,68.56 200.25,68.56 200.25,68.35 U2.18
  Bottom 0.508: v251.26,31.62 249.73,30.1 234.9,30.1 234.82,30.1 U1.1 228.32,27.41 227.18,28.55 197.99,28.55 197,29.54 172.95,29.54 v172.75,29.74 172.54,29.54 163.3,29.54 160,26.24 141.12,26.24 139.4,27.96 118.67,27.96 117.5,29.14 U7.18
A12  (via drill 0.65)
  Top 0.508: v175.49,24.56 175.49,28.37 175.77,28.65 175.77,61.2 174.47,62.5 174.47,62.51 D6.C 175.26,63.32 175.26,65.58 175.56,65.89 181.31,65.89 184.1,63.09 184.63,62.56 193.45,62.56 U2.21 | v253.16,30.58 253.16,30.53 253.19,30.5 253.19,34.59 253.82,35.23 258.8,40.21 258.8,40.95 258.8,44 278.64,58.13 278.64,65.89 J1.P$24
  Bottom 0.508: v253.16,30.58 253.13,30.58 251.93,29.39 236.32,29.39 234.67,27.74 U1.2 234.67,26.95 232.92,25.2 177.91,25.2 177.27,24.56 v175.49,24.56 174.86,25.19 140.9,25.19 139.19,26.9 117.65,26.9 115.73,28.82 U7.17
A13  (via drill 0.65)
  Top 0.508: D7.C 178.31,61.21 178.31,28.45 178.1,28.25 v178.1,23.7 | U1.3 237.21,29.11 235.59,30.73 230.91,30.73 230.5,31.14 227.86,33.78 227.86,46.61 234.44,53.19 244.19,53.19 247.55,55.57 247.55,70.1 250.75,73.3 253.67,76.22 287.68,76.22 292.66,71.25 292.63,71.22 J1.P$36
  Bottom 0.508: U1.3 237.21,26.54 235.13,24.46 180.22,24.46 179.45,23.7 v178.1,23.7 177.95,23.55 174.88,23.55 173.99,24.44 140.51,24.44 138.96,25.98 116.89,25.98 113.96,28.92 U7.16
A14  (via drill 0.65)
  Top 0.508: D8.C 180.8,61.24 180.8,28.42 180.62,28.25 v180.62,22.76 | J1.P$10 258.34,65.86 258.34,61.08 244.43,52.12 234.57,52.12 234.31,51.87 228.7,46.25 228.7,44.93 228.7,34.34 228.93,34.11 231.47,31.57 231.67,31.57 238.1,31.57 239.75,29.92 U1.4 | U11.10 124.48,19.28 126.42,21.21 136.58,21.21 138.81,23.44 v138.81,23.6
  Bottom 0.508: v138.81,23.6 138.86,23.55 173.23,23.55 174.19,22.58 180.44,22.58 v180.62,22.76 181.23,23.37 236.22,23.37 236.63,23.37 239.75,26.49 U1.4 | U11.10 119.58,12.47 98.09,12.47 96.98,11.35 U15.4
A15  (via drill 0.65)
  Top 0.508: v183.24,21.89 183.11,22.02 183.11,48.74 183.57,49.2 183.57,55.27 182.02,56.82 D9.C | 120.65,25.17 115.24,25.17 115.21,25.2 v115.19,25.2 | 120.65,25.17 121.94,25.17 U11.11 | 120.65,25.17 135.46,25.17 136.4,24.23 136.42,24.21 v136.47,24.21 | v106.96,25.65 99.52,18.21 U15.10 | U1.5 242.29,29.9 239.62,32.56 233.15,32.56 231.93,32.56 230.1,34.39 229.72,34.77 229.72,44.5 229.72,45.97 232.56,48.82 234.77,51.03 239.88,51.03 244.72,51.03 259.61,60.71 J1.P$9
  Bottom 0.508: v136.47,24.21 136.47,23.5 138.02,21.95 139.83,21.95 140.46,22.57 142.28,22.57 143.19,21.67 183.01,21.67 v183.24,21.89 187.35,21.89 189.03,20.22 209.37,20.22 211.48,22.33 238.74,22.33 242.29,25.88 U1.5 | v115.19,25.2 114.07,24.08 108.53,24.08 v106.96,25.65
B
  Bottom 0.508: U12.4 173.23,74.55 172.26,75.51 170.94,75.51 168.12,78.33 166.7,78.33 164.95,78.33 162.59,80.7 145.52,80.7 144.58,80.7 143.79,79.91 143.23,79.35 136.85,79.35 134.54,81.66 132.89,81.66 U8.22
CASS.IN  (via drill 0.65)
  Top 0.508: v82.27,61.14 82.27,61.11 80.14,63.25 80.14,66.98 76.83,70.28 76.83,73.36 78.61,75.13 78.61,78.11 76.81,79.91 66.17,79.91 Q1.1 | v116.03,54.38 116.05,54.36 116.1,54.36 123.9,54.36 126.33,51.93 U7.42
  Bottom 0.508: v82.27,61.14 96.6,61.14 104.39,53.34 114.99,53.34 v116.03,54.38 | R18.2 50.34,72.64 55.12,77.42 63.68,77.42 65.53,79.27 Q1.1
CASS.OUT
  Bottom 0.508: 147.14,64.08 146.94,63.88 | 147.88,64.82 146.94,63.88 | 146.94,63.88 146.1,63.04 145.09,63.04 144.22,62.18 144.22,61.8 144.22,60.98 142.54,59.31 C30.- 142.47,59.23 141.48,58.24 140.06,58.24 131.72,58.24 124.56,51.08 U7.43
  Bottom 0.813: 147.88,64.82 R24.1
CBF  (via drill 0.65)
  Top 0.508: v137.62,80.67 v137.62,64.82
  Bottom 0.508: v137.62,80.67 140.06,83.11 170.94,83.11 173.03,81.03 U12.15 | v137.62,64.82 137.62,62.51 136.75,61.65 126.44,61.65 117.48,52.68 U7.47
CD00  (via drill 0.65)
  Top 0.508: v34.29,62.66 34.31,62.64 34.34,62.64 36.47,60.5 36.47,47.37 35.1,46 35.13,45.97 U4.9 | v63.02,68.1 63.04,68.07 63.04,68.02 62.92,68.15 62.92,74.24 R6.2
  Bottom 0.508: v34.29,62.66 35.76,61.19 48.31,61.19 55.22,68.1 v63.02,68.1 78.13,68.1 78.31,68.28 83.87,68.28 87.02,71.42 92.18,71.42 U8.34
CD01  (via drill 0.65)
  Top 0.508: v67.89,70.64 67.94,70.59 67.94,70.56 67.89,70.61 R7.2 | U4.10 37.67,46.15 38.89,47.37 38.89,64.59 38.43,65.05 v38.41,65.05
  Bottom 0.508: v38.41,65.05 40.62,62.84 47.65,62.84 55.45,70.64 v67.89,70.64 76.91,70.64 82.19,75.92 89.05,75.92 U8.37
CD02  (via drill 0.65)
  Top 0.508: v42.44,67.26 42.47,67.23 43,66.7 43,56.06 41.53,54.59 41.53,46.63 40.21,45.31 U4.11 | R8.2 v72.97,72.92
  Bottom 0.508: v42.44,67.26 45.31,64.39 46.71,64.39 55.32,73 72.9,73 v72.97,72.92 75.79,72.92 81,78.13 86.92,78.13 87.99,79.2 U8.39
CD03  (via drill 0.65)
  Top 0.508: v44.48,68.33 44.45,68.33 45.41,67.36 45.41,56.36 45.41,56.29 42.75,53.62 U4.13
  Bottom 0.508: v44.48,68.33 49.45,68.33 57.4,76.28 73.53,76.28 R9.2 75.59,74.32 81.2,79.93 U8.40
CD04  (via drill 0.65)
  Top 0.508: v40.46,66.17 40.49,66.17 41.27,65.38 41.27,56.84 40.21,55.78 U4.14 | v70.43,71.91 70.46,71.93 70.51,71.93 70.48,71.91 70.48,74.22 R10.2
  Bottom 0.508: v40.46,66.17 43.05,63.58 47.14,63.58 55.5,71.93 70.41,71.93 v70.43,71.91 76.53,71.91 81.51,76.89 87.48,76.89 U8.38
CD05  (via drill 0.65)
  Top 0.508: U4.15 37.67,62.56 37.64,62.56 v36.42,63.78 | R11.2 v65.41,69.34
  Bottom 0.508: v36.42,63.78 38.2,62 47.93,62 55.3,69.37 65.38,69.37 v65.41,69.34 82.83,69.34 86.18,72.69 91.67,72.69 95.53,76.56 95.53,79.86 U8.36
CD06  (via drill 0.65)
  Top 0.508: v32.05,62.59 32.03,62.59 35.15,59.46 35.15,48.97 U4.16 | v60.48,66.83 60.4,66.9 60.4,74.24 R12.2
  Bottom 0.508: v32.05,62.59 34.21,60.43 48.62,60.43 55.07,66.88 60.43,66.88 v60.48,66.83 | 60.43,66.78 v60.48,66.83 | v60.48,66.83 78.66,66.83 79.1,67.26 84.45,67.26 87.55,70.36 92.28,70.36 97.46,75.54 100.84,75.54 103.23,77.93 U8.33
CD07  (via drill 0.65)
  Top 0.508: v30.28,59.64 30.28,59.61 32.66,57.23 32.59,57.15 U4.17 | v57.94,65.51 57.94,65.3 57.89,65.25 57.89,74.24 R13.2
  Bottom 0.508: v30.28,59.64 48.97,59.64 54.84,65.51 v57.94,65.51 57.96,65.48 79.2,65.48 80.14,66.42 85.42,66.42 88.44,69.44 92.63,69.44 97.81,74.62 101.65,74.62 105.77,78.74 U8.32
COMP-LO
  Bottom 0.508: R42.1 152.2,103 R41.1 152.2,115.06 MOD1.1
CP/M  (via drill 0.65)
  Top 0.508: U15.9 102.06,16.23 99.52,13.69 U15.5 | v143.74,43.59 143.74,43.48 145.19,42.04 145.19,21.49 141.68,17.98 141.55,17.98 134.85,17.98 131.12,14.25 v131.12,14.28
  Bottom 0.508: v131.12,14.28 122.99,14.28 120.52,11.81 100.94,11.81 99.52,10.39 U15.5 | v143.74,43.59 124.69,43.59 122.79,45.49 U7.44
D00  (via drill 0.65)
  Top 0.508: 226.54,19.68 223.24,19.68 220.57,22.35 220.57,55.98 220.34,56.21 219.18,57.38 219.18,58.83 220.04,59.69 v220.07,59.72 | 226.54,19.68 256.51,19.68 256.67,19.84 258.88,19.84 259.71,19 v259.74,19 | 226.54,19.68 226.62,19.61 v226.62,16.31 226.62,16.23 226.59,16.2 | v161.95,72.69 161.95,67.97 160.15,66.17 160.15,59.97 160.63,59.49 v160.63,59.46 | U9.11 v208,13.79 | v204.85,60.98 206.45,59.38 206.45,51.99 U2.9
  Bottom 0.508: v259.74,19 259.74,19.23 265.25,24.74 265.25,27.3 U1.14 | v226.62,16.31 226.54,16.38 221.72,16.38 217.78,12.45 209.35,12.45 v208,13.79 189.92,13.79 187.48,16.23 155.04,16.23 153.92,17.35 137.57,17.35 134.29,20.62 111.45,20.62 110.82,21.26 103.15,21.26 101.55,22.86 101.57,22.88 U7.9 | v220.07,59.72 216.48,63.3 207.06,63.3 204.85,61.09 v204.85,60.98 204.85,60.25 201.6,57 183.59,57 182.17,58.42 161.67,58.42 v160.63,59.46 | v161.95,72.69 161.95,74.27 160.5,75.72 157.43,75.72 153.97,75.72 153.24,74.98 151.79,73.53 132.89,73.53 132.49,73.94 113.61,73.94 105.77,66.09 U8.9
D01  (via drill 0.65)
  Top 0.508: v261.98,19.66 261.98,19.68 260.86,20.8 223.52,20.8 221.34,22.99 221.34,56.44 220.93,56.84 220.93,57.53 221.59,58.19 221.51,58.12 v221.44,58.12 | v220.57,13.51 220.57,13.44 220.57,18.06 218.26,20.37 218.26,54.05 215.67,56.64 215.67,60.17 v215.67,60.25 | v159.38,72.77 159.46,72.77 159,72.31 159,58.12 v160.1,57.17 | v208.13,59.16 209.22,58.06 209.22,54.66 211.18,52.7 U2.10
  Bottom 0.508: v261.98,19.66 262.33,19.66 267.79,25.12 267.79,27.3 U1.15 | v221.44,58.12 217.47,58.12 215.67,59.92 v215.67,60.25 213.92,62 211,62 208.15,59.16 v208.13,59.16 205.16,59.16 202.08,56.08 183.13,56.08 181.91,57.3 160.22,57.3 v160.1,57.17 | v159.38,72.77 159.38,74.12 158.6,74.91 154.53,74.91 152.45,72.82 113.64,72.82 108.31,67.49 U8.10 | U9.5 205.83,9.93 207.56,11.66 218.72,11.66 v220.57,13.51
D02  (via drill 0.65)
  Top 0.508: v157.15,72.75 157.12,72.72 157.91,71.93 157.91,56.31 157.94,56.34 v157.94,56.39 | v211.4,57.99 211.4,56.75 213.72,54.44 U2.11 213.72,45.23 213.08,44.6 U9.9 213.08,13.78 213.03,13.73 214.15,12.61 214.15,11.43 217.09,8.48 224.94,8.48 v225.96,9.5
  Bottom 0.508: v225.96,9.5 226.01,9.45 228.78,9.45 232.69,5.54 252.45,5.54 255.02,8.1 255.02,12.78 254.25,13.54 254.25,17.83 255.4,18.97 260.15,23.72 260.15,27.33 U1.12 | v211.4,57.99 209.65,57.99 206.76,55.09 182.52,55.09 181.25,56.36 162.69,56.36 162.03,55.7 158.62,55.7 v157.94,56.39 | v157.15,72.75 156.51,72.11 114.3,72.11 110.85,68.66 U8.11
D03  (via drill 0.65)
  Top 0.508: v218.24,18.72 217.6,19.36 217.6,20.04 217.5,20.14 217.5,53.31 217.04,53.77 214.1,56.72 214.1,59.03 214.1,62.33 216.26,64.49 U2.13 215.54,65.76 v215.54,70.64
  Bottom 0.508: v215.54,70.64 213.18,73 208.03,73 205.97,70.94 115.11,70.94 113.39,69.22 U8.12 | U9.13 204.65,15.82 215.34,15.82 v218.24,18.72 243.18,18.72 249.91,25.45 U1.8
D04  (via drill 0.65)
  Top 0.508: 214.63,17.78 214.63,17.53 215.09,17.07 215.59,16.56 215.59,15.98 215.59,13.21 216.15,12.65 217.47,11.33 217.47,10.13 v217.45,10.16 | 214.63,17.78 214.63,19.81 214.63,21.06 214.1,21.59 214.1,44.68 214.55,45.14 214.83,45.41 214.83,51.59 214.83,54.59 212.83,56.59 212.83,64.16 U2.14 213.72,69.37 v213,70.08 | v214.66,19.79 214.66,17.8 214.63,17.78
  Bottom 0.508: v213,70.08 213,70.97 211.86,72.11 208.41,72.11 206.5,70.21 117.22,70.21 115.93,68.91 U8.13 | v214.66,19.79 214.86,19.99 242.06,19.99 247.37,25.3 U1.7 | U9.3 202.31,8 215.29,8 v217.45,10.16
D05  (via drill 0.65)
  Top 0.508: U9.7 210.54,12.68 v212.04,14.17 212.04,16.42 212.01,16.45 212.01,45.33 212.4,45.71 212.4,52.77 210.24,54.93 210.24,64.11 U2.15 210.67,65.56 v210.67,70.05
  Bottom 0.508: v210.67,70.05 209.75,70.97 208.53,70.97 207.01,69.44 120.9,69.44 118.47,67 U8.14 | v212.04,14.17 212.52,13.69 217.4,13.69 221.11,17.4 244.7,17.4 252.55,25.25 252.55,27.3 U1.9
D06  (via drill 0.65)
  Top 0.508: v217.22,68.81 217.42,68.61 217.42,56.21 219,54.63 219,21.11 221.89,18.21 221.89,15.14 223.16,13.87 228.04,13.87 231.85,17.68 244.58,17.68 247.32,17.68 249.22,15.77 249.22,15.82 v249.2,15.85 | U2.16 208.64,68.48 v208.76,68.61
  Bottom 0.508: v217.22,68.81 217.02,68.61 v208.76,68.61 123.42,68.61 121.01,66.19 U8.15 | v249.2,15.85 249.2,17.91 254.99,23.7 U1.10
D07  (via drill 0.65)
  Top 0.508: v219.3,66.55 219.33,66.57 218.21,65.46 218.21,56.82 219.71,55.32 219.71,21.79 222.86,18.64 222.86,15.6 223.52,14.94 227.38,14.94 230.3,17.86 231.22,18.77 251.99,18.77 256.31,18.77 257.12,17.96 257.1,17.98 v257.02,17.98
  Bottom 0.508: v257.02,17.98 257.02,18.64 262.66,24.28 262.66,27.36 U1.13 | v219.3,66.55 218.92,66.93 206.1,66.93 | 204.52,66.93 204.47,66.93 | 204.47,66.93 125.65,66.93 123.55,64.82 U8.16 | 204.47,66.93 206.1,66.93 | U2.17 206.1,66.93
DE00
  Bottom 0.508: J1.P$26 281.23,65.84 281.23,65.73 281.23,60.86 278.99,58.62 249.05,58.62 243.56,53.14 238.86,53.14 230.12,61.87 230.12,69.85 215.32,84.66 215.32,87.48 212.5,90.3 177.22,90.3 176.91,90.6 117.91,90.6 108.31,81 U8.31
DE01
  Bottom 0.508: J1.P$27 282.47,60.5 282.37,60.4 280.52,58.55 279.17,57.2 249.15,57.2 247.29,55.35 244.04,52.09 241.32,52.09 238.35,52.09 233.38,57.07 229.06,61.39 229.06,67.79 229.06,69.34 214.3,84.1 214.3,85.7 214.3,87 211.86,89.43 176.1,89.43 176.07,89.46 118.57,89.46 110.85,81.74 U8.30
DE02
  Bottom 0.508: U8.29 113.39,82.93 119.02,88.57 211.1,88.57 213.44,86.23 213.44,83.46 228.14,68.76 228.14,63.91 228.14,60.91 232.89,56.16 237.82,51.23 241.5,51.23 244.53,51.23 249.33,56.03 279.48,56.03 281.81,58.37 283.79,60.35 283.79,65.81 J1.P$28
DE03
  Bottom 0.508: J1.P$29 285.01,60.15 284.96,60.1 282.98,58.12 279.63,54.76 249.43,54.76 247.85,53.19 245.03,50.37 241.02,50.37 237.21,50.37 231.72,55.85 227.23,60.35 227.23,66.75 227.23,67.69 214.12,80.8 210.44,80.8 203.5,87.73 120.34,87.73 115.93,83.31 U8.28
DE04
  Bottom 0.508: J1.P$30 286.33,65.81 286.33,60.17 283.85,57.68 279.48,53.31 249.28,53.31 245.47,49.51 241.28,49.51 236.65,49.51 231.98,54.18 226.37,59.79 226.37,66.34 226.37,67.21 213.87,79.7 210.08,79.7 202.89,86.9 122.2,86.9 118.47,83.16 U8.27
DE05
  Bottom 0.508: J1.P$31 287.55,60.27 279.4,52.12 261.82,52.12 249.2,52.12 248.82,51.74 245.8,48.72 241.1,48.72 236.02,48.72 225.6,59.13 225.6,64.06 225.6,66.8 213.72,78.69 209.78,78.69 202.51,85.95 124.87,85.95 121.01,82.09 U8.26
DE06
  Bottom 0.508: J1.P$32 288.72,65.96 288.72,60.33 285.17,56.77 279.45,51.05 249.1,51.05 246.07,48.03 240.97,48.03 235.53,48.03 224.84,58.73 224.84,64.85 224.84,66.42 213.54,77.72 209.42,77.72 202.16,84.99 127.15,84.99 123.55,81.38 U8.25
DE07
  Bottom 0.508: J1.P$33 290.09,60.6 279.32,49.84 248.97,49.84 246.48,47.35 240.69,47.35 234.93,47.35 224.13,58.14 224.13,64.49 224.13,65.81 213.18,76.76 209.02,76.76 201.78,84 129.16,84 126.09,80.92 U8.24
DOT  (via drill 0.65)
  Top 0.508: v78.74,15.47 78.79,15.42 79.73,16.36 79.73,20.78 81.58,22.63 81.58,28.93 79.2,31.32 79.2,48.9 80.85,50.55 80.85,51.82 87.99,58.95 U8.2
  Bottom 0.508: v78.74,15.47 62.05,15.47 57.45,20.07 47.7,20.07 46.97,20.8 43.92,20.8 U6.9
DT00
  Top 0.508: U6.11 U6.10
  Bottom 0.508: U6.11 37.8,19.94 39.5,21.64 47.45,21.64 48.18,20.9 53.54,20.9 U5.9 | U6.10 40.34,18.97 41.48,17.83 44.73,17.83 45.95,19.05 C38.2
DT01
  Bottom 0.508: U6.12 35.26,20.02 37.85,22.61 48.06,22.61 48.69,21.97 52.07,21.97 52.12,21.97 52.12,22.02 U5.10
DT02
  Bottom 0.508: U6.13 36.55,23.6 48.77,23.6 49.4,22.96 50.65,22.96 52.55,24.87 U5.11
DT03  (via drill 0.65)
  Top 0.508: v50.01,17.93 U5.13
  Bottom 0.508: v50.01,17.93 49.12,17.04 32.89,17.04 U6.14
DT04  (via drill 0.65)
  Top 0.508: v52.48,16.94 52.48,9.83 U5.14
  Bottom 0.508: v52.48,16.94 51.77,16.23 34.04,16.23 30.18,12.37 U6.3
DT05  (via drill 0.65)
  Top 0.508: v55.04,15.98 55.04,9.8 U5.15
  Bottom 0.508: v55.04,15.98 54.51,15.44 35.92,15.44 32.72,12.24 U6.4
DT06  (via drill 0.65)
  Top 0.508: v57.63,14.71 U5.16
  Bottom 0.508: v57.63,14.71 57.53,14.61 37.54,14.61 35.26,12.32 U6.5
DT07  (via drill 0.65)
  Top 0.508: v60.27,13.89 60.27,9.86 U5.17
  Bottom 0.508: v60.27,13.89 58.88,12.5 48.44,12.5 46.05,10.11 39.83,10.11 U6.6
G
  Bottom 0.508: U12.3 170.69,74.6 167.77,77.52 166.47,77.52 164.59,77.52 163.35,78.77 162.2,79.91 152.45,79.91 145.19,79.91 144.27,78.99 143.76,78.49 135.15,78.49 U8.21
GND  (via drill 0.65)
  Top 0.508: R55.1 134.77,9.32 D16.A
  Top 0.813: J1.P$44 304.06,67.13 304.57,67.64 | v306.76,21.54 305.97,21.54 303.53,21.54 303.4,21.41 301.52,19.53 300.38,19.53 298.17,19.53 296.93,20.78 v293.68,20.78 289.74,20.78 287.53,18.57 ZD1.A 278.79,18.57 277.57,19.79 277.57,21.03 280.64,24.11 284.56,24.11 284.61,24.11 286.71,26.21 286.71,29.01 283.72,32 R45.1 | U3.20 60.02,49.1 60.02,51.28 59.56,51.74 59.56,53.77 59.61,53.82 59.61,54.38 56.34,57.66 v56.34,61.14 | U14.1 190.27,107.59 190.3,107.59 190.82,106.41 Q8.3 | v84.53,19.61 85.04,20.12 85.67,20.12 87.4,21.84 U7.1 87.4,33.05 93.34,38.99 v112.27,38.99 | v262.97,8.03 260.25,10.74 255.68,10.74 | 255.68,10.74 253.97,9.04 253.47,9.04 252.37,10.13 C6.- 251.41,9.27 v244.2,9.27 C28.1 | C7.1 255.68,13.36 255.68,10.74 | C42.2 4.39,119.46 6.15,117.7 19.02,117.7 21.01,119.69 C40.2 21.01,123.24 22.07,124.31 37.54,124.31 39.4,122.45 C41.2 51.89,109.07 C9.- 57.58,113.49 C8.- | F1.0 23.67,92.84 26.29,90.22 F2.2 | C33.1 184.33,107.11 U16.7 | J2.16 202.03,27.25 202.03,30.76 199.24,33.55 192,33.55 185.72,39.83 185.72,57.86 C24.2
  Bottom 0.508: R15.2 47.5,25.32 | Q5.3 31.37,24.43 25.09,24.43 21.46,20.8 C10.1
  Bottom 0.813: v84.53,19.61 84.94,20.02 110.08,20.02 R49.1 | v160.63,97.94 159.77,97.08 151.26,97.08 149.07,99.26 146.48,99.26 146.47,99.28 | R45.1 272.39,32 271.25,30.86 v268.12,30.86 | R44.2 228.98,108.76 227.61,108.76 227.13,108.76 225.04,106.68 226.31,105.41 | U15.7 106.43,10.03 107.75,8.71 C25.2 | U3.12 77.98,33.53 81.46,30.05 87.33,30.05 U7.1 | U2.12 217.75,51.31 227.74,51.31 v228.24,51.82 235.28,44.78 257.94,44.78 U1.29 | U12.16 170.69,80.92 172.49,79.12 190.93,79.12 192.63,80.82 C29.1 | U16.7 184.33,102.13 182.22,100.03 178.54,100.03 178.03,99.52 v178.03,98.25 | U14.8 205.05,113 193.27,113 193.04,112.78 192.84,112.78 190.27,110.21 U14.1 | R23.1 142.95,50.88 U7.33 | ZD1.A 280.44,9.98 280.01,9.55 277.65,7.19 263.8,7.19 v262.97,8.03 | C36.1 134.54,93.32 | 134.54,93.37 134.54,93.32 | J1.P$34 291.92,68.96 300.96,68.96 J1.P$44 | v215.85,26.95 202.34,26.95 J2.16 | C13.+ 16.69,87.33 25.4,87.33 F2.2 | v26.42,64.47 26.16,64.21 26.16,60.71 28.7,58.17 50.34,58.17 53.31,61.14 v56.34,61.14 56.64,61.44 78.08,61.44 C17.2 81.99,64.69 U8.1 85.45,64.8 88.72,68.07 91.95,68.07 | 123.97,93.37 123.36,93.98 124.03,93.32 134.54,93.32 | 302.69,67.31 302.69,67.11 302.69,67.31
  other vias: 2.29,6.71 169.77,10.77 212.83,75.18 259.82,34.9 165.68,93.55 160.76,127.61 226.72,129.01 11.46,52.04 14,41.88
  pour Top: 87.28,6.16 82.25,6.16 82.25,13.39 83.55,14.4 83.55,15.66 83.06,16.34 83.17,19.47 84.21,20.75 85.51,20.79 86.46,21.72 86.64,34.48 83.78,37.79 83.78,40.18 83.17,40.95 83.15,42.14 86.17,45.07 111.93,45.07 115.39,41.65 129.54,41.65 132.78,38.4 134.76,38.4 139.53,33.81 139.58,32.77 139.17,32.46 88.69,32.46 88.2,31.86 88.2,21.85 86.01,19.24 84.72,19.15 84.43,18.81 84.43,16.76 87.28,13.4
  pour Top: 11.14,0.75 12.31,2.19 12.31,9.67 13.57,11.07 15.82,11.07 16.65,10.21 16.65,6.27 20.14,2.78 37.98,2.78 39.82,4.63 51.31,4.63 53.29,2.78 103.28,2.78 105.71,4.81 117.2,4.81 119.22,2.69 173.62,2.69 176.1,5.08 188.49,5.08 190.65,3.23 218.75,3.23 220.78,5.55 220.51,7.26 214.66,7.24 213.75,8.14 213.75,10.75 212.47,10.75 212.47,8.21 211.54,7.28 200.38,7.28 199.66,6.56 195.65,6.56 194.97,7.24 193.4,7.24 192.87,7.77 192.87,11 191.53,11.58 190.7,10.79 190.7,8.14 189.93,7.55 187.54,7.55 186.64,8.86 186.64,12.6 189.16,15.34 189.16,18.99 187.72,20.03 183.4,20.03 171.96,24.52 161.8,24.52 160.82,23.54 160.82,13.17 161.58,12.42 161.58,11.18 157.64,7.24 150.83,7.24 149.89,8.18 149.89,14.05 148.67,15.42 148.9,27.39 151.63,30.2 151.38,44.75 149.65,46.46 147.6,46.46 147.14,47.17 147.14,50.99 146.43,51.72 146.43,55.8 144.58,57.58 141.76,57.58 139.06,60.3 139.14,61.8 137.69,62.99 136.75,62.99 136.09,63.8 136.19,72.52 134.85,72.52 134.85,63.37 132.41,60.6 132.41,57.73 138.07,51.97 141.02,52.02 141.68,51.59 141.78,48.49 142.88,48.41 143.36,49.25 144.35,49.94 145.75,49.23 145.8,46.33 146.91,45.29 149.3,45.31 150.32,44.27 150.27,43.26 146.13,39.47 146.15,13.97 147.32,12.8 147.45,7.92 146.76,7.24 143.95,7.24 142.6,8.95 142.6,12.6 141.15,14.04 134.58,14.04 133.45,12.91 133.45,8.68 132.19,7.33 131.43,7.33 130.48,8.72 130.44,10.35 129.58,10.75 128.77,10.44 128.63,9.49 129.22,8.36 128.27,7.42 108.48,7.42 108.48,8.84 107.65,9.67 106.93,8.95 106.93,7.37 88.15,7.37 86.21,9.31 82.79,9.31 81.03,7.55 64.1,7.55 63.38,8.27 63.3,12.37 63.33,12.37 63.33,21.11 61.8,22.37 61.8,24.76 61.89,24.76 61.89,26.56 62.93,27.91 62.93,30.43 62.03,31.06 49.19,31.06 48.29,31.96 48.29,46.6 47.71,47.18 43.74,47.18 41.1,44.24 41.1,35.89 41.52,35.37 41.52,31.66 41.27,31.42 39.82,31.38 39.1,30.48 39.01,24.71 38.1,23.77 34.09,23.79 32.79,25.55 27.95,25.55 26.84,24.44 26.84,19.01 24.57,16.74 24.57,15.71 25.77,14.51 41.01,14.51 42.11,13.41 42.11,10.67 41.45,10.01 29.8,10.01 27.26,7.46 23.84,7.46 13.48,18 13.48,19.22 13.79,19.94 13.79,21.78 13.21,22.64 13.21,23.18 13.58,23.59 13.58,27.01 12,27.01 12,23.1 9.25,20.48 5.94,20.5 5.94,0.74
  pour Top (rank 3): 274 corners
  pour Top: 215.87,21.14 214.85,22.16 214.85,43.66 215.69,44.5 215.69,48.34 215.75,49.96 216.83,49.96 216.83,18.2 219.2,15.83 219.2,12.73 219.86,11.98 221.78,11.98 222.83,12.9 227.23,13 227.25,10.98 223.55,10.69 222.22,9.37 220.61,9.37 216.56,13.42 216.56,16.7 215.87,17.36
  cutout Top: 79.38,87.79 79.32,86.53 79.89,85.96 80.64,84.82 81.99,84.82 83.4,86.23 83.4,87.67 82.68,88.21 82.08,88.81 80.64,88.81
  cutout Top: 84.21,89.74 83.04,90.91 83.04,92.72 83.94,93.62 87.01,93.62 88.24,92.39 88.24,90.67 86.33,88.77 85.21,88.77
  cutout Top: 91.54,92.9 91.54,90.64 92.92,89.26 94.38,88.52 96.29,90.43 96.29,92.99 95.65,93.63 92.28,93.63
  pour Top: 255.32,30.42 253.85,32.04 253.85,34.05 259.2,39.85 259.2,43.29 261.12,43.29 261.19,41.16 263.52,38.67 265.11,38.67 266.22,37.56 266.22,32.82 267.3,31.65 268.29,31.65 268.29,30.42
  pour Top: 160.44,97.65 163.72,94.25 163.72,90.73 161.56,89.16 161.56,79.47 162.7,78.12 178.58,78.12 181.1,75.65 182.54,75.56 183.13,75.83 182.96,76.64 179.77,79.65 179.77,83.21 181.78,83.21 182.27,84.02 182.27,93.08 181.15,93.84 179.16,93.84 178.4,94.67 178.22,94.99 178.22,97.02 179.18,97.98 179.53,98.55 183.4,98.55 183.71,98.86 183.67,99.27 183.24,99.34 172.12,99.34 172.12,95 172.77,94.31 172.77,93.5 172.25,92.87 172.25,87.02 176.74,82.73 176.83,79.58 176.1,79 172.25,79 171.67,79.4 171.64,82.17 171.64,83.38 170.24,84.81 170.07,92.21 169.48,92.93 166.85,92.93 165.5,94.45 165.2,95.06 162.28,98.05 161.07,98.28
  cutout Top: 2.15,129.57 2.15,127.13 4.33,124.94 39.38,124.94 41.17,123.16 58.89,123.16 60.76,125.02 60.76,128.18 58.18,130.75 3.08,130.53